# Altium schematic sheet PopAudio.SchDoc
size Legal
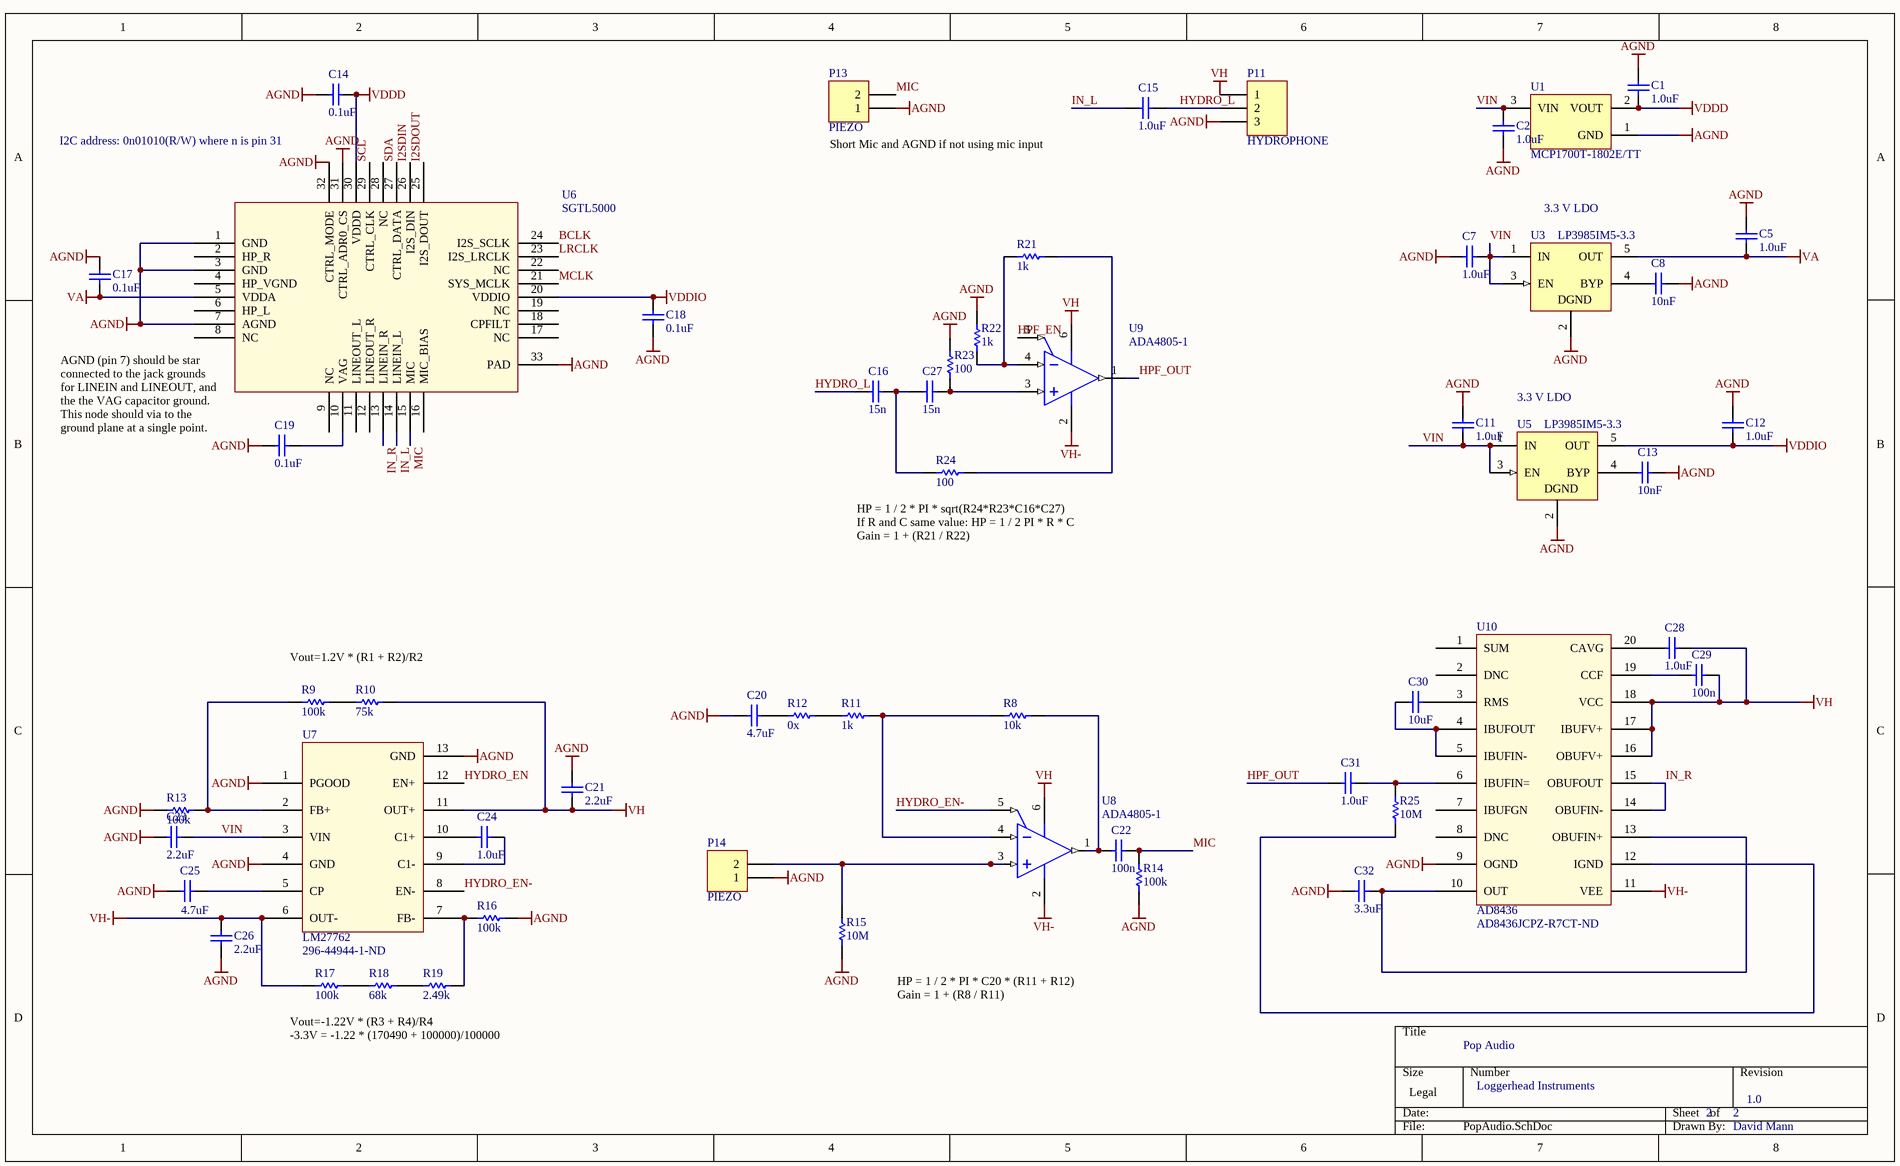
[diagram p0: PopAudio.SchDoc]

## Parts
C1  1.0uF  [0402]
C2  1.0uF  [0402]
C5  1.0uF  [0402]
C7  1.0uF  [0402]
C8  10nF  [0402]
C11  1.0uF  [0402]
C12  1.0uF  [0402]
C13  10nF  [0402]
C14  0.1uF  [0402]
C15  1.0uF  [0402]
C16  15n  [0402]
C17  0.1uF  [0402]
C18  0.1uF  [0402]
C19  0.1uF  [0402]
C20  4.7uF  [0603]
C21  2.2uF  [0402]
C22  100n  [0402]
C23  2.2uF  [0402]
C24  1.0uF  [0402]
C25  4.7uF  [0603]
C26  2.2uF  [0402]
C27  15n  [0402]
C28  1.0uF  [0402]
C29  100n  [0402]
C30  10uF  [0402]
C31  1.0uF  [0402]
C32  3.3uF  [0402]
P11  HYDROPHONE  [HDR1X3]
P13  PIEZO  [HDR1X2]
P14  PIEZO  [HDR1X2]
R8  10k  [3-0603]
R9  100k  [3-0603]
R10  75k  [3-0603]
R11  1k  [3-0603]
R12  0x  [3-0603]
R13  100k  [3-0603]
R14  100k  [3-0603]
R15  10M  [3-0603]
R16  100k  [3-0603]
R17  100k  [3-0603]
R18  68k  [3-0603]
R19  2.49k  [3-0603]
R21  1k  [3-0603]
R22  1k  [3-0603]
R23  100  [3-0603]
R24  100  [3-0603]
R25  10M  [3-0603]
U1  MCP1700T-1802E/TT  [SOT-23-TT3_N]
U3  LP3985IM5-3.3  [MF05A_N]
U5  LP3985IM5-3.3  [MF05A_N]
U6  SGTL5000  [QFN32]
U7  LM27762  Supplier Part Number 1: 296-44944-1-ND  [SOP12]
U8  ADA4805-1  [ADI-RJ-6_N]
U9  ADA4805-1  [ADI-RJ-6_N]
U10  AD8436  Supplier Part Number 1: AD8436JCPZ-R7CT-ND  [AD8436]

## Nets
AGND: C1.2 C2.2 C5.2 C7.2 C8.1 C11.2 C12.2 C13.1 C14.2 C17.2 C18.2 C19.2 C20.2 C21.2 C23.2 C25.1 C26.2 C32.2 P11.3 P13.1 P14.1 R13.1 R14.2 R15.2 R16.2 R22.2 R23.2 U1.1(GND) U3.2(GND) U5.2(GND) U6.1(GND) U6.3(GND) U6.7(AGND) U6.31(CTRL_ADR0_CS) U6.32(CTRL_MODE) U6.33(PAD) U7.1(PGOOD) U7.4(GND) U7.13(GND) U10.9(OGND)
VA: C5.1 C17.1 U3.5(OUT) U6.5(VDDA)
VDDD: C1.1 C14.1 U1.2(VOUT) U6.30(VDDD)
VDDIO: C12.1 C18.1 U5.5(OUT) U6.20(VDDIO)
VH: C21.1 C28.1 C29.2 P11.1 R10.2 U7.11(OUT+) U8.6(+VS) U9.6(+VS) U10.16(OBUFV+) U10.17(IBUFV+) U10.18(VCC)
VH-: C26.1 R17.2 U7.6(OUT-) U8.2(-VS) U9.2(-VS) U10.11(VEE)
BCLK: U6.24(I2S_SCLK)
HPF_EN: U9.5(~{POWER_DOWN})
HPF_OUT: C31.2 U9.1(VOUT)
HYDRO_EN: U7.12(EN+)
HYDRO_EN-: U7.8(EN-) U8.5(~{POWER_DOWN})
HYDRO_L: C15.1 C16.1 P11.2
I2SDIN: U6.26(I2S_DIN)
I2SDOUT: U6.25(I2S_DOUT)
IN_L: C15.2 U6.14(LINEIN_L)
IN_R: U6.13(LINEIN_R) U10.14(OBUFIN-) U10.15(OBUFOUT)
LRCLK: U6.23(I2S_LRCLK)
MCLK: U6.21(SYS_MCLK)
MIC: C22.2 P13.2 R14.1 U6.15(MIC)
SCL: U6.29(CTRL_CLK)
SDA: U6.27(CTRL_DATA)
VIN: C2.1 C7.1 C11.1 C23.1 U1.3(VIN) U3.1(IN) U3.3(EN) U5.1(IN) U5.3(EN) U7.3(VIN)
NetC8_2: C8.2 U3.4(BYP)
NetC13_2: C13.2 U5.4(BYP)
NetC16_2: C16.2 C27.1 R24.1
NetC19_1: C19.1 U6.10(VAG)
NetC20_1: C20.1 R12.1
NetC22_1: C22.1 R8.2 U8.1(VOUT)
NetC24_1: C24.1 U7.9(C1-)
NetC24_2: C24.2 U7.10(C1+)
NetC25_2: C25.2 U7.5(CP)
NetC27_2: C27.2 R23.1 U9.3(+IN)
NetC28_2: C28.2 U10.20(CAVG)
NetC29_1: C29.1 U10.19(CCF)
NetC30_1: C30.1 U10.3(RMS)
NetC30_2: C30.2 U10.4(IBUFOUT) U10.5(IBUFIN-)
NetC31_1: C31.1 R25.1 U10.6(IBUFIN=)
NetC32_1: C32.1 U10.10(OUT) U10.13(OBUFIN+)
NetP14_2: P14.2 R15.1 U8.3(+IN)
NetR8_1: R8.1 R11.2 U8.4(-IN)
NetR9_1: R9.1 R13.2 U7.2(FB+)
NetR9_2: R9.2 R10.1
NetR11_1: R11.1 R12.2
NetR16_1: R16.1 R19.1 U7.7(FB-)
NetR17_1: R17.1 R18.2
NetR18_1: R18.1 R19.2
NetR21_1: R21.1 R22.1 U9.4(-IN)
NetR21_2: R21.2 R24.2
NetR25_2: R25.2 U10.12(IGND)

Not connected (* = marked no-connect by the designer): U6 2(HP_R) 4(HP_VGND) 6(HP_L) 8(NC) 9(NC) 11(LINEOUT_L) 12(LINEOUT_R) 16(MIC_BIAS) 17(NC) 18(CPFILT) 19(NC) 22(NC) 28(NC); U10 1(SUM) 2(DNC) 7(IBUFGN) 8(DNC)

## Notes on the sheet
- I2C address: 0n01010(R/W) where n is pin 31
- (near P13) Short Mic and AGND if not using mic input
- (near U3) 3.3 V LDO
- (near U6) AGND (pin 7) should be star connected to the jack grounds for LINEIN and LINEOUT, and the the VAG capacitor ground. This node should via to the ground plane at a single point.
- 3.3 V LDO
- (near R24) HP = 1 / 2 * PI * sqrt(R24*R23*C16*C27)
  If R and C same value: HP = 1 / 2 PI * R * C
  Gain = 1 + (R21 / R22)
- Vout=1.2V * (R1 + R2)/R2
- Vout=-1.22V * (R3 + R4)/R4
  -3.3V = -1.22 * (170490 + 100000)/100000
- HP = 1 / 2 * PI * C20 * (R11 + R12)
  Gain = 1 + (R8 / R11)
- Pop Audio
- Loggerhead Instruments
- 2
- 1.0
- David Mann
- (in symbol LP3985IM5-3.3) DGND

## Library data of the parts
C1 C2 C5 C7 C8 C11-C13 C15 C16 C21-C24 C26-C32 = C0402: Ceramic Chip Capacitor - Standard; Note: Footprint corresponds to dimensions for bulk cassette packaging. This case size has tightened tolerances.; Value: 0.1uF; Published: 17-Jul-2002; LatestRevisionDate: 19-Mar-2004; LatestRevisionNote: Silkscreen size reduced.; DatasheetDocument: Mar-2001; PackageDocument: Mar-2001; PackageReference: 0402; Publisher: Altium Limited; Code_JEITA: 0402; Code_IPC: 1005 [0402]; ComponentLink1Description: Manufacturer Link; ComponentLink1URL: http://www.kemet.com/; ComponentLink2Description: Datasheet; ComponentLink2URL: http://www.kemet.com/kemet/web/homepage/kechome.nsf/vapubfilesname/F3102TA.pdf/$file/F3102TA.pdf
C14 C17-C19 = C0402: Ceramic Chip Capacitor - Standard; Note: Footprint corresponds to dimensions for bulk cassette packaging. This case size has tightened tolerances.; Published: 17-Jul-2002; LatestRevisionDate: 19-Mar-2004; LatestRevisionNote: Silkscreen size reduced.; DatasheetDocument: Mar-2001; PackageDocument: Mar-2001; PackageReference: 0402; Publisher: Altium Limited; Code_JEITA: 0402; Code_IPC: 1005 [0402]; ComponentLink1Description: Manufacturer Link; ComponentLink1URL: http://www.kemet.com/; ComponentLink2Description: Datasheet; ComponentLink2URL: http://www.kemet.com/kemet/web/homepage/kechome.nsf/vapubfilesname/F3102TA.pdf/$file/F3102TA.pdf; Value: 0.1uF
C20 C25 = C0603: Ceramic Chip Capacitor - Standard; Note: Footprint corresponds to dimensions for bulk cassette packaging. This case size has tightened tolerances.; Published: 17-Jul-2002; LatestRevisionDate: 19-Mar-2004; LatestRevisionNote: Silkscreen size reduced.; DatasheetDocument: Mar-2001; PackageDocument: Mar-2001; PackageReference: 0603; Publisher: Altium Limited; Code_JEITA: 0603; Code_IPC: 1608 [0603]; ComponentLink1Description: Manufacturer Link; ComponentLink1URL: http://www.kemet.com/; ComponentLink2Description: Datasheet; ComponentLink2URL: http://www.kemet.com/kemet/web/homepage/kechome.nsf/vapubfilesname/F3102TA.pdf/$file/F3102TA.pdf; Value: 4.7uF
P11 = Header 3: Header, 3-Pin; LatestRevisionDate: 17-Jul-2002; LatestRevisionNote: Re-released for DXP Platform.; Publisher: Altium Limited
P13 P14 = Header 2: Header, 2-Pin; LatestRevisionDate: 17-Jul-2002; LatestRevisionNote: Re-released for DXP Platform.; Publisher: Altium Limited
R8-R19 R21-R25 = ERJ3RK: Precision Thick Film Chip Resistor, 10 Ohm to 1M Ohm Range, 1% and 0.5% Tolerance, 0603 Size, 0.063 W; Published: 17-Dec-2003; LatestRevisionDate: 19-Mar-2004; LatestRevisionNote: Silkscreen size reduced.; PackageDocument: Mar-2003; PackageReference: 3-0603; Publisher: Altium Limited; Code_IPC: 1608 [0603]; ComponentLink1Description: Manufacturer Link; ComponentLink1URL: http://www.panasonic.com/industrial/components/resistive_products.htm; ComponentLink2Description: Datasheet; ComponentLink2URL: http://www.panasonic.com/industrial/components/pdf/AOA0000CE2.pdf
U1 = MCP1700T-1802E/TT: Low Quiescent Current LDO, 3-Pin SOT-23, Extended Temperature, Tape and Reel; Manufacturer: Microchip; DatasheetVersion: revB, Feb-2007; PackageVersion: revBB, Aug-2009; PackageReference: SOT-23-TT3; PackageDescription: 3-Lead Plastic Small Outline Transistor (TT) [SOT-23]; Supplier 1: Digi-Key; Supplier Part Number 1: MCP1700T1802ETTTR-ND; Supplier 2: Digi-Key; Supplier Part Number 2: MCP1700T1802ETTCT-ND; Supplier 3: Digi-Key; Supplier Part Number 3: MCP1700T1802ETTDKR-ND; Supplier 4: Farnell; Supplier Part Number 4: 1296591RL; Supplier 5: Farnell; Supplier Part Number 5: 1296591; Supplier 6: Newark; Supplier Part Number 6: 84R5175; Supplier 7: Mouser; Supplier Part Number 7: 579-MCP1700T1802E/TT; Mounting Technology: Surface Mount; Code_IPC: SOT23-3; PartNumber: MCP1700T-1802E/TT; ComponentLink1Description: Manufacturer URL; ComponentLink1URL: http://www.microchip.com/; ComponentLink2Description: Datasheet; ComponentLink2URL: http://ww1.microchip.com/downloads/en/DeviceDoc/21826b.pdf; ComponentLink3Description: Package Specification; ComponentLink3URL: http://www.microchip.com/stellent/groups/techpub_sg/documents/packagingspec/en012702.pdf
U3 U5 = LP3985IM5-3.3: Micropower, 150mA Low-Noise Ultra Low-Dropout CMOS Voltage Regulator; Manufacturer: National Semiconductor; CompType: LDO IC; PackageTopMarking: LDQB*XTT; PowerWise: N; Published: 4-Dec-2008; DatasheetVersion: Aug-2005; PackageVersion: revD, Aug-2008; PackageReference: MF05A; Publisher: Altium Limited; PackageDescription: Molded SOT-23, .115 x .063 x .040 in Body, 5 Lead, .0375 in Pitch; PartNumber: LP3985IM5-3.3; RoHS: O; PinCount: 5; DigiKeyPartNumber: LP3985IM5-3.3CT-ND; ComponentLink1Description: LP3985 Datasheet; ComponentLink1URL: http://www.national.com/ds/LP/LP3985.pdf; ComponentLink2Description: LP3985 Web Page; ComponentLink2URL: http://www.national.com/pf/LP/LP3985.html; ComponentLink3Description: MF05A Package Page; ComponentLink3URL: http://www.national.com/packaging/folders/mf05a.html
U7 = LM27762: Pos and Neg Output Charge pump plus LDO; Supplier 1: Digi-Key
U8 U9 = ADA4841-1YRJZ-RL: Single Channel Low Wide Band Noise Operational Amplifier, 80 MHz BW, 13 V/us SR, Industrial, 6-pin SOT23 (RJ-6), Reel; Manufacturer: Analog Devices; Amplifiers Per Package: 1; Input Bias Current: 3uA; Input Offset Voltage: 40uV; Iq/Amp: 1.5mA; Slew Rate: 13V/us; Small Signal Bandwidth: 80MHz; V Span Max: 12V; V Span Min: 2.7V; DatasheetVersion: Rev. E; PackageVersion: 121608-A; PackageReference: RJ-6; PackageDescription: 6-Pin Small Outline Transistor Package, Body 2.9 x 1.6 mm, Pitch 0.95 mm; Supplier 1: Digi-Key; Supplier Part Number 1: ADA4841-1YRJZ-RL-ND; Generic Part Number: ADA4841-1; Mounting Technology: Surface Mount; Code_JEDEC: MO-178-AB; PartNumber: ADA4841-1YRJZ-RL; ComponentLink1Description: Manufacturer URL; ComponentLink1URL: http://www.analog.com/en/index.html; ComponentLink2Description: Datasheet; ComponentLink2URL: http://www.analog.com/static/imported-files/data_sheets/ADA4841-1_4841-2.pdf; ComponentLink3Description: Package Specification; ComponentLink3URL: http://www.analog.com/static/imported-files/packages/PKG_PDF/SOT-23(RJ)/RJ_6.pdf; ComponentLink4Description: Reference Circuit; ComponentLink4URL: http://www.analog.com/en/all-operational-amplifiers-op-amps/operational-amplifiers-op-amps/ada4841-1/products/product.html#product-recommendations
U10 = AD8436: RMS to DC; Supplier 1: Digi-Key